# EAGLE schematic samd21_actuatorhub_Lite_TQFP32_1.0_feb2023 (EAGLE 9.6.2)
MODEL: SensorHub Lite; VERSION: V1.1.2 Feb 2023

## Sheet 1 of 3
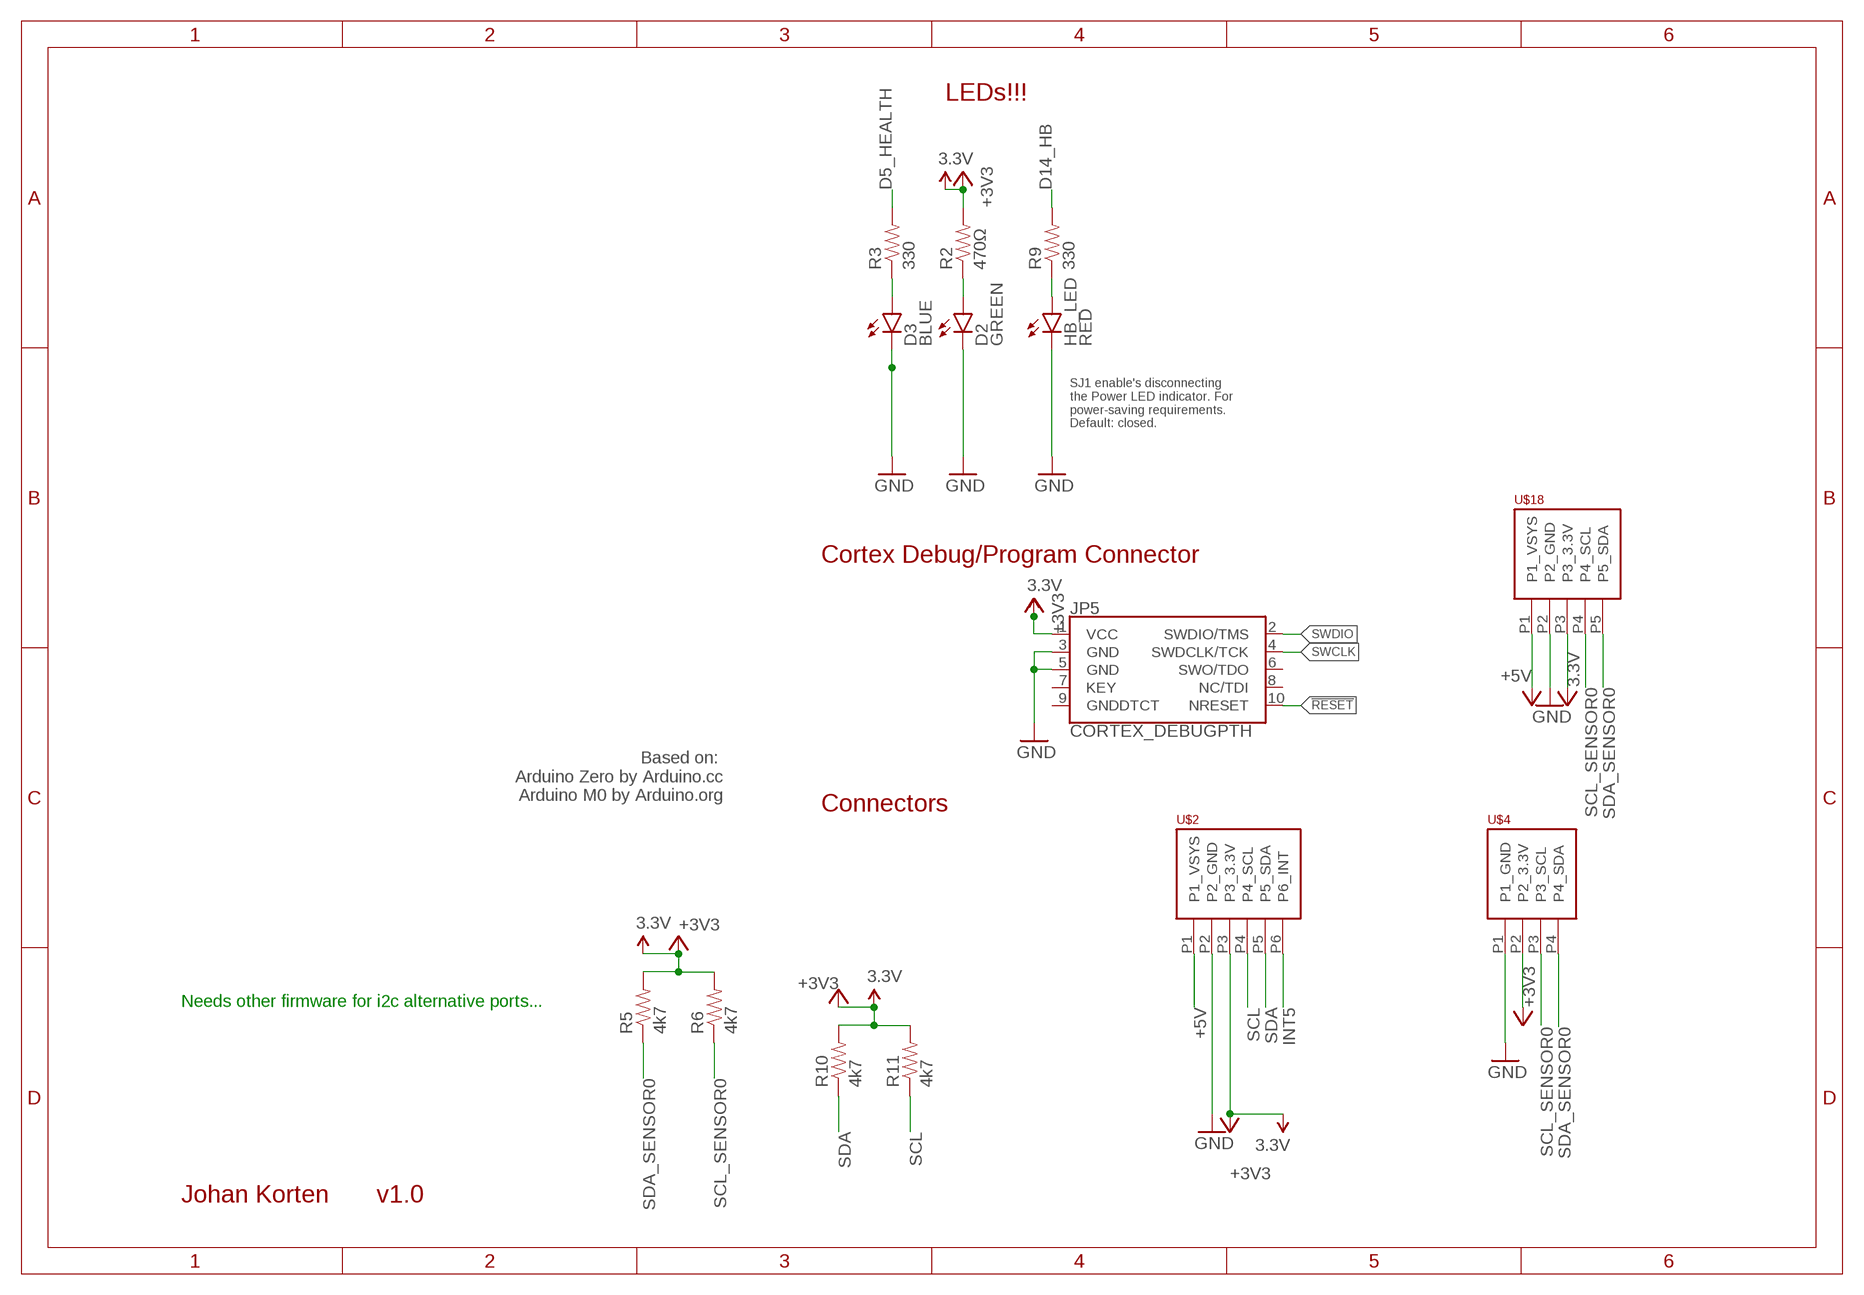
[diagram p0: schematic, sheet 1]

### Parts
D2  GREEN  LED-RED0603  [LED-0603]
D3  BLUE  LED-BLUE0603  [LED-0603]
HB_LED  RED  LED-RED0603  [LED-0603]
JP5  CORTEX_DEBUGPTH  [2X5-PTH-1.27MM]
R2  470Ω  330OHM1/10W1%(0603)  [0603-RES]
R3  330  330OHM1/10W1%(0603)  [0603-RES]
R5  4k7  330OHM1/10W1%(0603)  [0603-RES]
R6  4k7  330OHM1/10W1%(0603)  [0603-RES]
R9  330  330OHM1/10W1%(0603)  [0603-RES]
R10  4k7  330OHM1/10W1%(0603)  [0603-RES]
R11  4k7  330OHM1/10W1%(0603)  [0603-RES]
U$2  PHOENIX_PTSM_M6_TH_I2CPPANGLE  [PTSM_M6_THRHOLE]
U$4  PHOENIX_PTSM_M4_THANGLE  [PTSM_M4_TH]
U$18  PHOENIX_PTSM_M5_TH_I2C++  [PTSM_M5_THRHOLE]

### Nets
3.3V [power]: JP5.1(VCC) R2.2 R5.2 R6.2 R10.2 R11.2 U$2.P3(P3_3.3V) U$4.P2(P2_3.3V) U$18.P3(P3_3.3V) ; supply symbol labelled +3V3 ; also sheet 2
!RESET: JP5.10(NRESET) ; also sheet 2
+5V: U$2.P1(P1_VSYS) U$18.P1(P1_VSYS) ; also sheet 2,3
D5_HEALTH: R3.2 ; also sheet 2
D5_HEALTH_LED: D3.A R3.1
D14_HB: R9.2 ; also sheet 2
D14_HB_LED: HB_LED.A R9.1
GND [ground]: D2.C D3.C HB_LED.C JP5.3(GND) JP5.5(GND) U$2.P2(P2_GND) U$4.P1(P1_GND) U$18.P2(P2_GND) ; also sheet 2,3
INT5: U$2.P6(P6_INT) ; also sheet 2
N$5: D2.A R2.1
SCL: R11.1 U$2.P4(P4_SCL) ; also sheet 2
SCL_SENSOR0: R6.1 U$4.P3(P3_SCL) U$18.P4(P4_SCL) ; also sheet 2
SDA: R10.1 U$2.P5(P5_SDA) ; also sheet 2
SDA_SENSOR0: R5.1 U$4.P4(P4_SDA) U$18.P5(P5_SDA) ; also sheet 2
SWCLK: JP5.4(SWDCLK/TCK) ; also sheet 2
SWDIO: JP5.2(SWDIO/TMS) ; also sheet 2
Unconnected: JP5.6(SWO/TDO) JP5.7(KEY) JP5.8(NC/TDI) JP5.9(GNDDTCT)

### Notes on the sheet
- LEDs!!!
- SJ1 enable's disconnecting
  the Power LED indicator. For
  power-saving requirements.
  Default: closed.
- Cortex Debug/Program Connector
- Based on: 
  Arduino Zero by Arduino.cc
  Arduino M0 by Arduino.org
- Connectors
- Needs other firmware for i2c alternative ports...
- Johan Korten | v1.0

## Sheet 2 of 3: Controller SAMD21 based on Adafruit Feather M0 Express
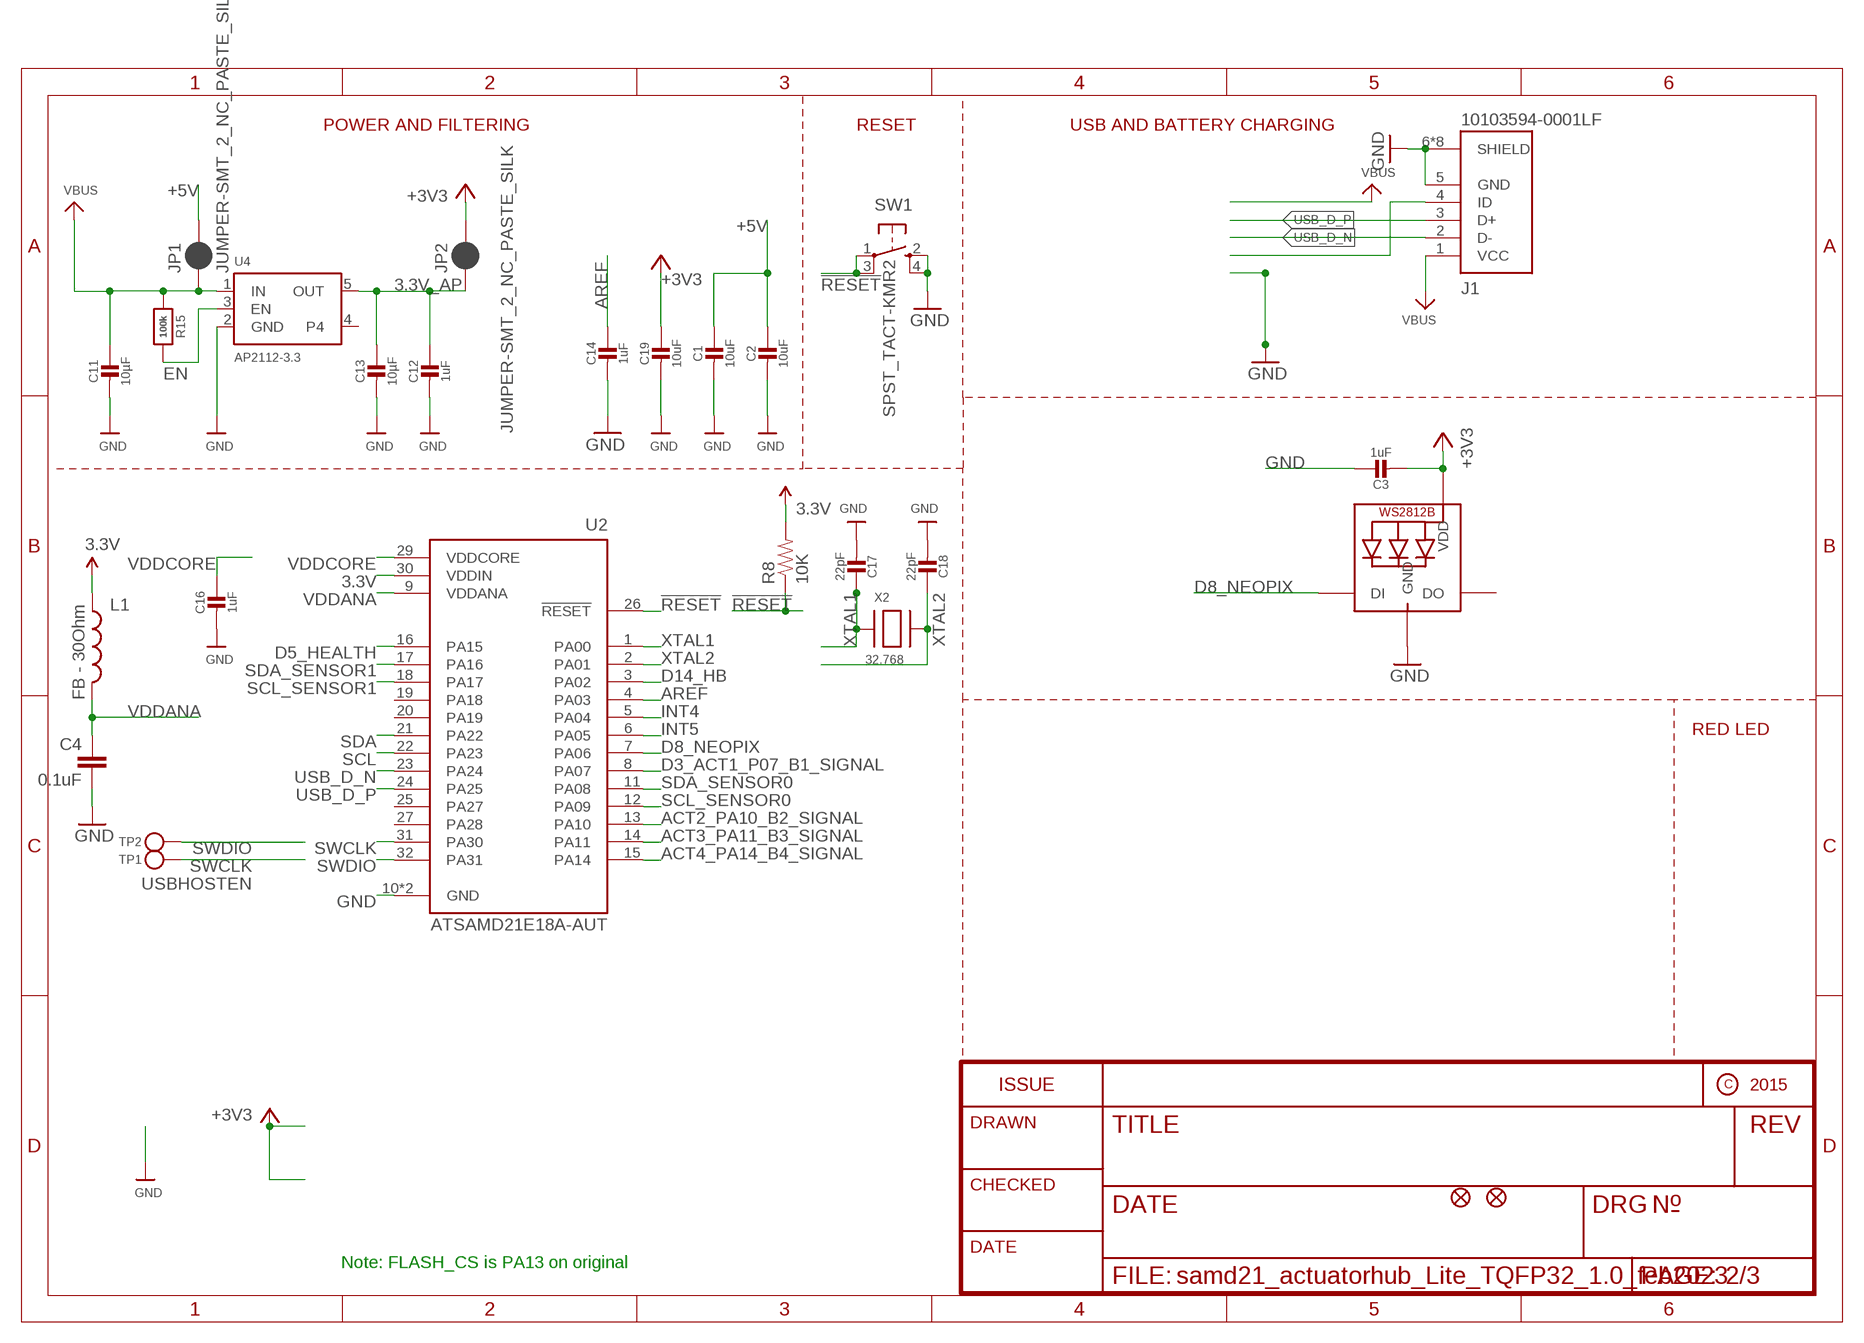
[diagram p1: schematic, sheet 2]

### Parts
C1  10uF  CAP_CERAMIC0805-NOOUTLINE  [0805-NO]
C2  10uF  CAP_CERAMIC0805-NOOUTLINE  [0805-NO]
C3  1uF  CAP_CERAMIC0603_NO  [0603-NO]
C4  0.1uF  0.1UF-16V(+-10%)(0402)  [0402-CAP]
C11  10µF  CAP_CERAMIC0805-NOOUTLINE  [0805-NO]
C12  1uF  CAP_CERAMIC0603_NO  [0603-NO]
C13  10µF  CAP_CERAMIC0805-NOOUTLINE  [0805-NO]
C14  1uF  CAP_CERAMIC0603_NO  [0603-NO]
C16  1uF  CAP_CERAMIC0603_NO  [0603-NO]
C17  22pF  CAP_CERAMIC0603_NO  [0603-NO]
C18  22pF  CAP_CERAMIC0603_NO  [0603-NO]
C19  10uF  CAP_CERAMIC0805-NOOUTLINE  [0805-NO]
J1  10103594-0001LF  [AMPHENOL_10103594-0001LF]
JP1  JUMPER-SMT_2_NC_PASTE_SILK  [SMT-JUMPER_2_NC_PASTE_SILK]
JP2  JUMPER-SMT_2_NC_PASTE_SILK  [SMT-JUMPER_2_NC_PASTE_SILK]
L1  FB - 30Ohm  INDUCTOR0603  [0603]
LED1  WS2812B3535  [LED3535]
R8  10K  10KOHM-1/10W-1%(0603)0603  [0603-RES]
R15  100k  RESISTOR_0603_NOOUT  [0603-NO]
SW1  SPST_TACT-KMR2  [KMR2]
TP1  TESTPOINTROUND1.5MM  [TESTPOINT_ROUND_1.5MM]
TP2  TESTPOINTROUND1.5MM  [TESTPOINT_ROUND_1.5MM]
U2  ATSAMD21E18A-AUT  [QFP80P900X900X120-32N]
U4  AP2112-3.3  VREG_SOT23-5  [SOT23-5]
U$34  FIDUCIAL""  [FIDUCIAL_1MM]
U$35  FIDUCIAL""  [FIDUCIAL_1MM]
X2  32.768  XTAL-3.2X1.5  [XTAL3215]

### Nets
3.3V [power]: C3.2 C19.1 JP2.2 L1.1 LED1.2(VDD) R8.2 U2.30(VDDIN) ; supply symbol labelled +3V3 ; also sheet 1
3.3V_AP [power]: C12.1 C13.1 JP2.1 U4.5(OUT)
!RESET: R8.1 SW1.1(P) SW1.3(P1) U2.26(!RESET) ; also sheet 1
+5V: C1.1 C2.1 JP1.2 ; also sheet 1,3
ACT2_PA10_B2_SIGNAL: U2.13(PA10) ; also sheet 3
ACT3_PA11_B3_SIGNAL: U2.14(PA11) ; also sheet 3
ACT4_PA14_B4_SIGNAL: U2.15(PA14) ; also sheet 3
AREF [power]: C14.1 U2.4(PA03)
D3_ACT1_P07_B1_SIGNAL: U2.8(PA07) ; also sheet 3
D5_HEALTH: U2.16(PA15) ; also sheet 1
D8_NEOPIX: LED1.1(DI) U2.7(PA06)
D14_HB: U2.3(PA02) ; also sheet 1
EN: R15.2 U4.3(EN)
GND [ground]: C1.2 C2.2 C3.1 C4.2 C11.2 C12.2 C13.2 C14.2 C16.2 C17.2 C18.2 C19.2 J1.5(GND) J1.6(SHIELD) J1.7(SHIELD) J1.8(SHIELD) J1.9(SHIELD) J1.10(SHIELD) J1.11(SHIELD) J1.S1(SHIELD) J1.S2(SHIELD) LED1.4(GND) SW1.2(S) SW1.4(S1) U2.10(GND) U2.28(GND) U4.2(GND) ; also sheet 1,3
INT4: U2.5(PA04)
INT5: U2.6(PA05) ; also sheet 1
N$8: J1.4(ID)
SCL: U2.22(PA23) ; also sheet 1
SCL_SENSOR0: U2.12(PA09) ; also sheet 1
SCL_SENSOR1: U2.18(PA17)
SDA: U2.21(PA22) ; also sheet 1
SDA_SENSOR0: U2.11(PA08) ; also sheet 1
SDA_SENSOR1: U2.17(PA16)
SWCLK: TP1.P$1 U2.31(PA30) ; also sheet 1
SWDIO: TP2.P$1 U2.32(PA31) ; also sheet 1
USB_D_N [usb]: J1.2(D-) U2.23(PA24)
USB_D_P [usb]: J1.3(D+) U2.24(PA25)
VBUS [power]: C11.1 J1.1(VCC) JP1.1 R15.1 U4.1(IN)
VDDANA: C4.1 L1.2 U2.9(VDDANA)
VDDCORE: C16.1 U2.29(VDDCORE)
XTAL1: C17.1 U2.1(PA00) X2.P$1
XTAL2: C18.1 U2.2(PA01) X2.P$2
Unconnected: LED1.3(DO) U2.19(PA18) U2.20(PA19) U2.25(PA27) U2.27(PA28) U4.4

### Notes on the sheet
- POWER AND FILTERING | RESET | USB AND BATTERY CHARGING
- RED LED
- USBHOSTEN
- Note: FLASH_CS is PA13 on original

## Sheet 3 of 3: Actuator Control
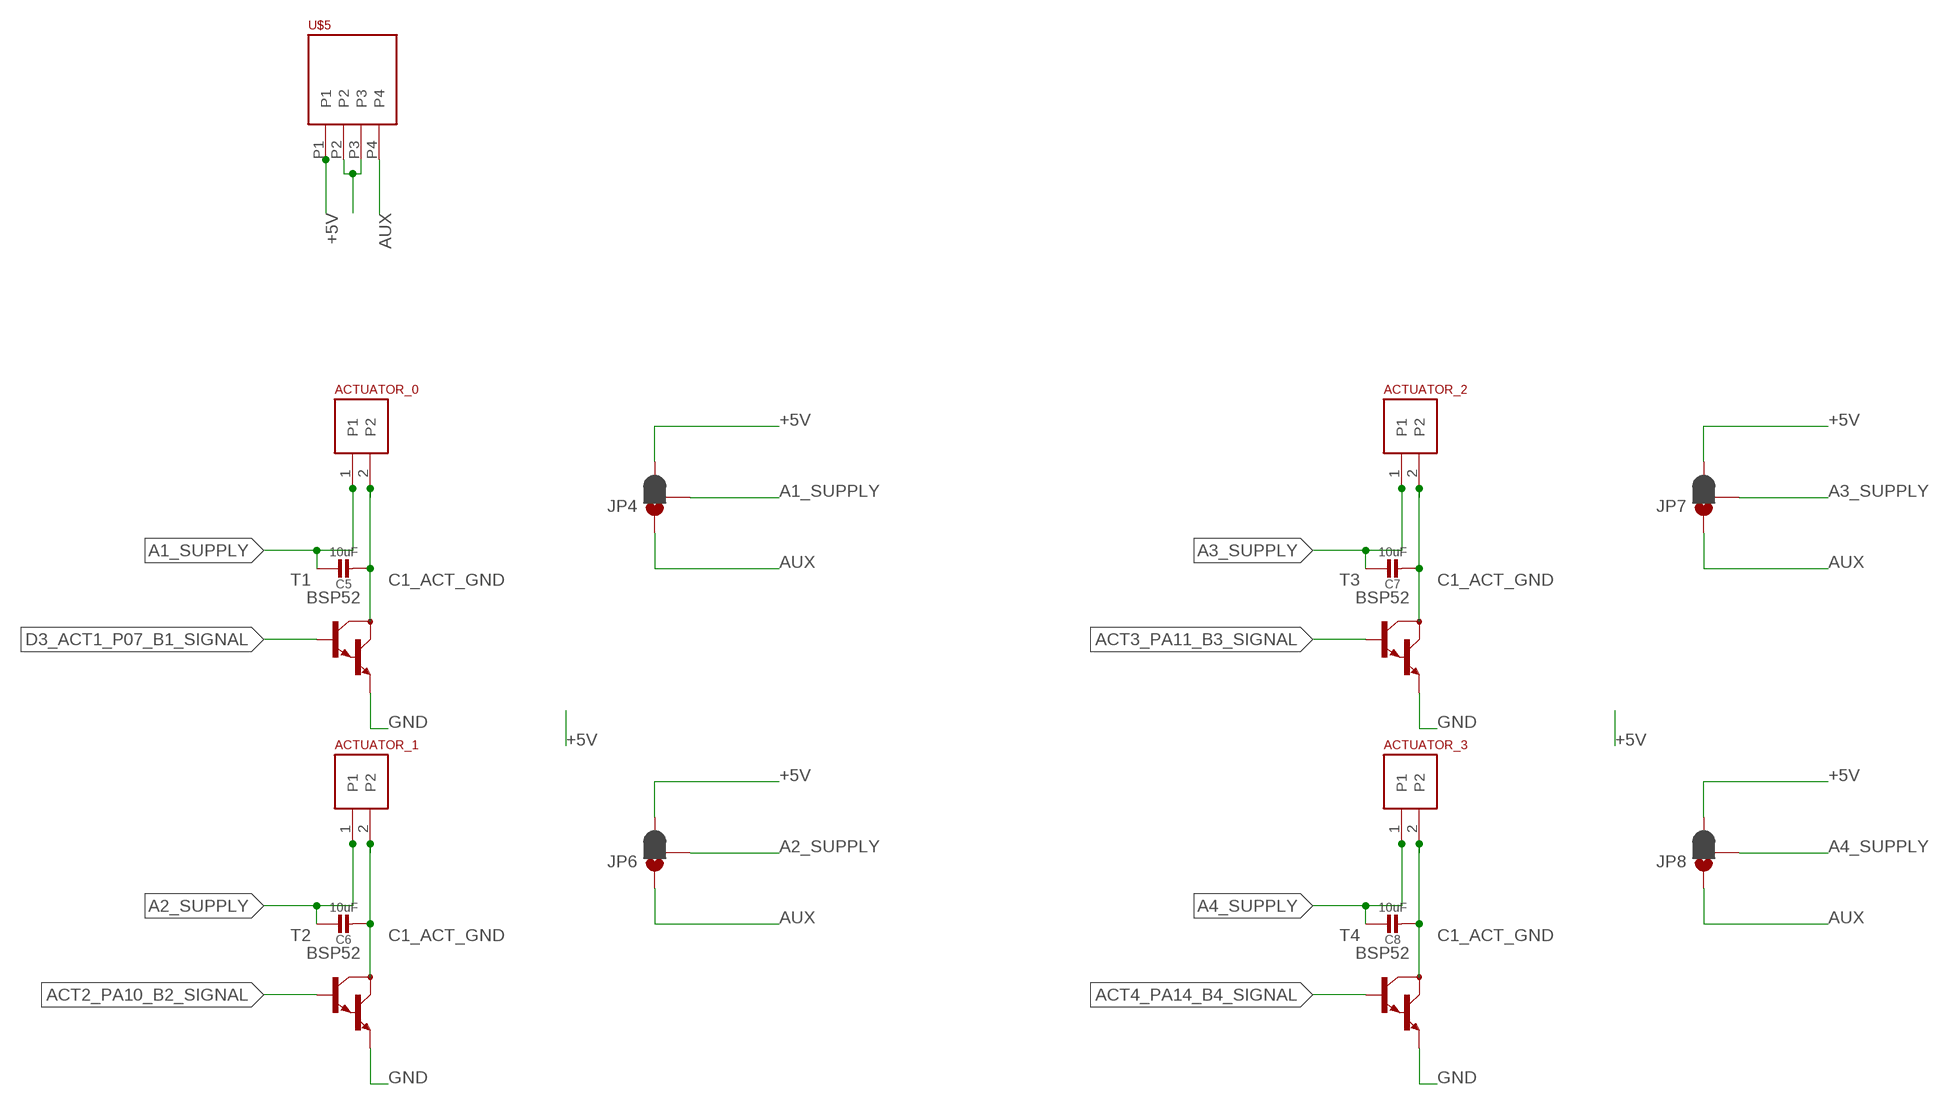
[diagram p2: schematic, sheet 3]

### Parts
ACTUATOR_0  PHOENIX_PTSM_M2TH  [PTSM_M2_THRHOLE]
ACTUATOR_1  PHOENIX_PTSM_M2TH  [PTSM_M2_THRHOLE]
ACTUATOR_2  PHOENIX_PTSM_M2TH  [PTSM_M2_THRHOLE]
ACTUATOR_3  PHOENIX_PTSM_M2TH  [PTSM_M2_THRHOLE]
C5  10uF  CAP_CERAMIC0805-NOOUTLINE  [0805-NO]
C6  10uF  CAP_CERAMIC0805-NOOUTLINE  [0805-NO]
C7  10uF  CAP_CERAMIC0805-NOOUTLINE  [0805-NO]
C8  10uF  CAP_CERAMIC0805-NOOUTLINE  [0805-NO]
JP4  JUMPER-SMT_3_1-NC_PASTE_SILK  [SMT-JUMPER_3_1-NC_PASTE_SILK]
JP6  JUMPER-SMT_3_1-NC_PASTE_SILK  [SMT-JUMPER_3_1-NC_PASTE_SILK]
JP7  JUMPER-SMT_3_1-NC_PASTE_SILK  [SMT-JUMPER_3_1-NC_PASTE_SILK]
JP8  JUMPER-SMT_3_1-NC_PASTE_SILK  [SMT-JUMPER_3_1-NC_PASTE_SILK]
T1  BSP52  [SOT-223-4]
T2  BSP52  [SOT-223-4]
T3  BSP52  [SOT-223-4]
T4  BSP52  [SOT-223-4]
U$5  PHOENIX_PTSM_M4_TH_ANGLE  [PTSM_M4_TH_ANGLE_NEUTRAL]

### Nets
+5V: JP4.3 JP6.3 JP7.3 JP8.3 U$5.P1 ; also sheet 1,2
A1_SUPPLY: ACTUATOR_0.1 C5.1 JP4.2
A2_SUPPLY: ACTUATOR_1.1 C6.1 JP6.2
A3_SUPPLY: ACTUATOR_2.1 C7.1 JP7.2
A4_SUPPLY: ACTUATOR_3.1 C8.1 JP8.2
ACT2_PA10_B2_SIGNAL: T2.1(B) ; also sheet 2
ACT3_PA11_B3_SIGNAL: T3.1(B) ; also sheet 2
ACT4_PA14_B4_SIGNAL: T4.1(B) ; also sheet 2
AUX: JP4.1 JP6.1 JP7.1 JP8.1 U$5.P4
C1_ACT_GND: ACTUATOR_0.2 ACTUATOR_1.2 ACTUATOR_2.2 ACTUATOR_3.2 C5.2 C6.2 C7.2 C8.2 T1.2(C) T1.4(C) T2.2(C) T2.4(C) T3.2(C) T3.4(C) T4.2(C) T4.4(C)
D3_ACT1_P07_B1_SIGNAL: T1.1(B) ; also sheet 2
GND [ground]: T1.3(E) T2.3(E) T3.3(E) T4.3(E) ; also sheet 1,2
N$1: U$5.P2 U$5.P3

## Library data of the parts
ACTUATOR_0 ACTUATOR_1-ACTUATOR_3 = jk_customs:PHOENIX_PTSM_M2
C1-C3 C5-C8 C11-C14 C16-C19 = microbuilder:CAP_CERAMIC: Ceramic Capacitors For new designs, use the packages preceded by an '_' character since they are more reliable: The following footprints should be used on most boards: _0402 - Standard footprint for regular board layouts _0603 - Standard footprint for regular board layouts _0805 - Standard footprint for regular board layouts _1206 - Standard footprint for regular board layouts For extremely tight-pitch boards where space is at a premium, the following 'micro-pitch' footprints can be used (smaller pads, no silkscreen outline, etc.): _0402MP - Micro-pitch footprint for very dense/compact boards _0603MP - Micro-pitch footprint for very dense/compact boards _0805MP - Micro-pitch footprint for very dense/compact boards _1206MP - Micro-pitch footprint for very dense/compact boards
C4 = SparkFun-Capacitors:0.1UF-16V(+-10%)(0402); PROD_ID: CAP-12416
D2 = SparkFun-LED:LED-RED: Assorted Red LEDs LilyPad 1206- DIO-09912 1206- DIO-00809 0603- DIO-00819 "SMART" means more efficient and expensive; PROD_ID: DIO-00819; VALUE: RED
D3 = SparkFun-LED:LED-BLUE: Blue LEDs for production use Various blue LEDs stocked by SparkFun production 0603 - DIO-08575 Rebel - DIO-09553 1206 - DIO-09911; PROD_ID: DIO-08575
HB_LED = SparkFun-LED:LED-RED: Assorted Red LEDs LilyPad 1206- DIO-09912 1206- DIO-00809 0603- DIO-00819 "SMART" means more efficient and expensive; PROD_ID: DIO-00819
J1 = 10103594-0001LF:10103594-0001LF: USB - micro B USB 2.0 Receptacle Connector 5 Position Surface Mount, Right Angle; Through Hole Check availability <https://pricing.snapeda.com/parts/10103594-0001LF/AMPHENOL%20ICC%20/%20FCI/view-part?ref=eda>; AVAILABILITY: In Stock; DESCRIPTION: Micro USB 2.0, Input Output Connectors, B TYPE RECEPTACLE; MF: AMPHENOL ICC / FCI; MP: 10103594-0001LF; PACKAGE: None; PRICE: None; PURCHASE-URL: https://pricing.snapeda.com/search/part/10103594-0001LF/?ref=eda
JP1 JP2 = SparkFun-Jumpers:JUMPER-SMT_2_NC_PASTE: Normally closed solder jumper This jumper has an aperture in the stencil to allow solder paste to bridge the split in the wire so it's normally closed (NC). Wick off the solder to open the connection. Reapply solder to reclose the connection.
JP4 JP6-JP8 = SparkFun-Jumpers:JUMPER-SMT_3_1-NC_PASTE: Normally closed solder jumper (1 of 2 connections) This jumper has an aperture in the stencil to allow solder paste to bridge one of the two connections. One connection is normally closed (NC), while the other is normally open (NO). Wick off the solder to open the connection. Reapply solder to reclose the connection. Apply solder to the other side instead to change the current path.
JP5 = samd21-temp:CORTEX_DEBUG: Cortex Debug Connector Datasheet <http://infocenter.arm.com/help/topic/com.arm.doc.faqs/attached/13634/cortex_debug_connectors.pdf>
L1 = SparkFun-Passives:INDUCTOR: Inductors Basic Inductor/Choke - 0603 and 1206. Footprints are not proven and vary greatly between part numbers. INDUCTOR POWER 3.3UH 4.0A SMD 0.197" L x 0.197" W x 0.177" H (5.00mm x 5.00mm x 4.50mm); PROD_ID: RES-07859
LED1 = microbuilder:WS2812B
R2 R5 R6 R10 R11 = SparkFun-Resistors:330OHM1/10W1%(0603): RES-00818; PROD_ID: RES-00818; VALUE: 330
R3 R9 = SparkFun-Resistors:330OHM1/10W1%(0603): RES-00818; PROD_ID: RES-00818
R8 = SparkFun-Resistors:10KOHM-1/10W-1%(0603): RES-00824; PROD_ID: RES-00824
R15 = microbuilder:RESISTOR: Resistors For new designs, use the packages preceded by an '_' character since they are more reliable: The following footprints should be used on most boards: _0402 - Standard footprint for regular board layouts _0603 - Standard footprint for regular board layouts _0805 - Standard footprint for regular board layouts _1206 - Standard footprint for regular board layouts For extremely tight-pitch boards where space is at a premium, the following 'micro-pitch' footprints can be used (smaller pads, no silkscreen outline, etc.): _0402MP - Micro-pitch footprint for very dense/compact boards _0603MP - Micro-pitch footprint for very dense/compact boards _0805MP - Micro-pitch footprint for very dense/compact boards _1206MP - Micro-pitch footprint for very dense/compact boards
SW1 = adafruit:SPST_TACT: SMT 6mm switch, EVQQ2 series http://www.ladyada.net/library/eagle
T1-T4 = BSP52:BSP52: BSP52: 1A, 80V, NPN Darlington Transistor 1 A Max Collector Current 80 V Max CE Voltage Datasheet <http://www.onsemi.com/pub_link/Collateral/BSP52T1-D.PDF> Check availability <https://pricing.snapeda.com/parts/BSP52/ON%20Semiconductor/view-part?ref=eda>; AVAILABILITY: In Stock; DESCRIPTION: Bipolar (BJT) Transistor NPN - Darlington 80 V 1 A - 800 mW Surface Mount SOT-223 (TO-261); MF: ON Semiconductor; MP: BSP52; PACKAGE: SOT-223-4 Fairchild Semiconductor; PRICE: None; PURCHASE-URL: https://pricing.snapeda.com/search/part/BSP52/?ref=eda
TP1 TP2 = microbuilder:TESTPOINT: Test Point Various test points for characterisation and PCB testing TESTPOINT_SMT - Compact Surface Mount Test Point [Digikey: 5016KTR-ND]
U2 = ATSAMD21E18A-AUT:ATSAMD21E18A-AUT: ARM Cortex-M0+ SAM D21E Microcontroller IC 32-Bit 48MHz 256KB (256K x 8) FLASH 32-TQFP (7x7) Check availability <https://pricing.snapeda.com/parts/ATSAMD21E18A-AU/Microchip/view-part?ref=eda>; AVAILABILITY: In Stock; DESCRIPTION: ARM® Cortex®-M0+ SAM D21E, Functional Safety (FuSa) Microcontroller IC 32-Bit Single-Core 48MHz 256KB (256K x 8) FLASH 32-TQFP (7x7); MF: Microchip; MP: ATSAMD21E18A-AU; PACKAGE: TQFP-32 Microchip; PRICE: None; PURCHASE-URL: https://pricing.snapeda.com/search/part/ATSAMD21E18A-AU/?ref=eda
U4 = microbuilder:VREG_SOT23-5: SOT23-5 Fixed Voltage Regulators Part Current Out V Out V In V Dropout θJA (°C/W) TJ (°C) Digikey Part No. ADP121 150mA 3.3V 3.4-5.5V 0.09V @ 150mA -- -- ADP121-AUJZ33R7CT-ND ADP121 150mA 3.0V 3.1-5.5V 0.09V @ 150mA -- -- ADP121-AUJZ30R7CT-ND ADP122 300mA 3.3V 3.4-5.5V 0.085V @ 300mA -- -- ADP122AUJZ-3.3-R7CT-ND ADP1712 300mA 3.3V 3.5-5.5V 0.17V @ 300mA -- -- ADP1712AUJZ-3.3-R7TR-ND AP7311 (Low Cost) 150mA 3.3V 3.5-6V 0.15V @ 150mA -- -- AP7311-33WG-7DICT-ND LD39015M18R 150mA 1.8V 1.9V-5.5V 0.08V @ 100mA -- -- 497-6977-1-ND LP2985A-33DBVR 150mA 3.3V 3.3-16V 0.28V @ 150mA 206 150 296-18479-1-ND MCP1824T-3302E/OT 300mA 3.3V 3.5V-6V 0.2V @ 300mA -- -- MCP1824T-3302E/OTCT-ND MIC5205-2.5YM5 TR 150mA 2.5V 2.7-16V 0.165V @ 150mA -- -- 576-1257-2-ND MIC5205-3.0YM5 TR 150mA 3.0V 3.2V-16V 0.165V @ 150mA -- -- 576-1258-2-ND MIC5205-3.3YM5 TR 150mA 3.3V 3.5V-16V 0.165V @ 150mA -- -- 576-1259-2-ND TPS780330220 150mA 3.3V+2.2V 3.6-5.5V 250mV Max -- -- 296-23332-1-ND TDA3663/N1,135 100mA 3.3V 3.5-45V 0.18V @ 50mA -- -- 568-5343-1-ND Max operating temp can be calculated using θJA, TJ (max junction temperature), and power in watts. Set the "Maximum Ambient Temperature" until it reaches TJ ("Max Junction Temperature"), which is the absolute limit for safe use of the regulator: Heat Sink Temperature Calculator <http://www.daycounter.com/Calculators/Heat-Sink-Temperature-Calculator.phtml> For example, With 12V source into a 3.3V LP2985 and a 30mA load, we are dissipating (12V-3.3V) * 0.03A = 0.261W. With a θJA of 206 °C/W, a TJ of 150°C, and 261mW we can safely use the chip without a heat sink up to 75°C (=147.1°C Junction Temperature).
U$2 = jk_customs:PHOENIX_PTSM_M6_TH_I2CPP
U$4 = jk_customs:PHOENIX_PTSM_M4_TH
U$5 = jk_customs:PHOENIX_PTSM_M4_TH_ANGLE
U$18 = jk_customs:PHOENIX_PTSM_M5_TH: Datasheet Phoenix PTSM 0,5/ 5-HH-2,5-THR R32 <https://www.phoenixcontact.com/online/portal/us?uri=pxc-oc-itemdetail:pid=1778654&library=usen&pdfmode=direct&pdflanguage=en>
U$34 U$35 = microbuilder:FIDUCIAL: Fiducial Alignment Points Various fiducial points for machine vision alignment.; BOM: EXCLUDE
X2 = adafruit2:XTAL: Low cost SMT crystals, no capacitors included http://www.ladyada.net/library/eagle

## Net classes
1 usb: width 0.152 mm, drill 0.254 mm, clearance 0.152 mm
2 ground: width 0.254 mm, drill 0.254 mm, clearance 0.152 mm
3 power: width 0.254 mm, drill 0.254 mm, clearance 0.152 mm